# EAGLE design CAN-IO (EAGLE 7.2.0)
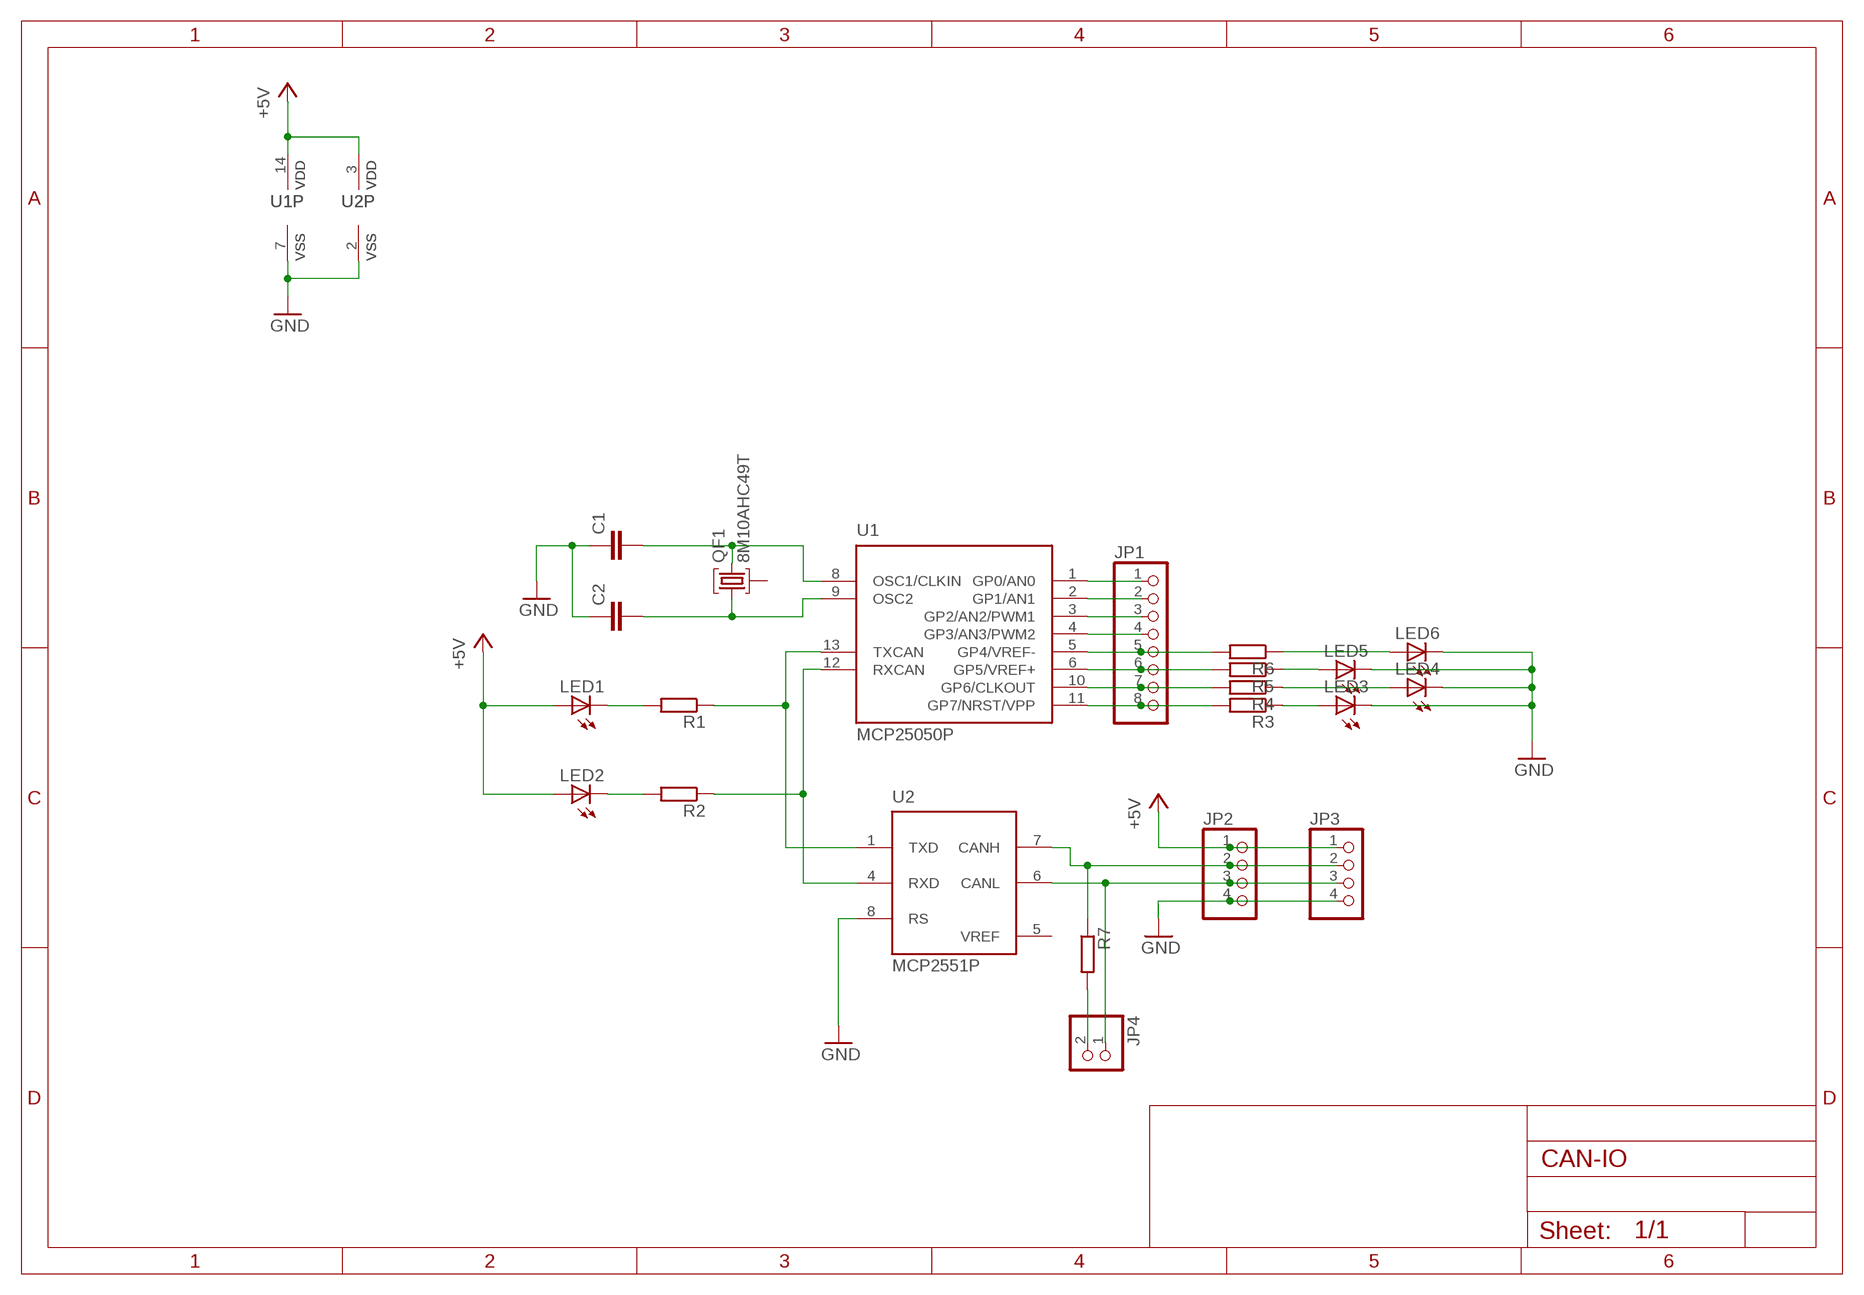
[diagram p0: schematic, sheet 1]

## Parts
C1  C-EU025-024X044  [C025-024X044]
C2  C-EU025-024X044  [C025-024X044]
JP1  PINHD-1X8  [1X08]
JP2  PINHD-1X4/90  [1X04/90]
JP3  PINHD-1X4/90  [1X04/90]
JP4  PINHD-1X2  [1X02]
LED1  LED5MM  [LED5MM]
LED2  LED5MM  [LED5MM]
LED3  LED5MM  [LED5MM]
LED4  LED5MM  [LED5MM]
LED5  LED5MM  [LED5MM]
LED6  LED5MM  [LED5MM]
QF1  8M10AHC49T  [HC49U]
R1  R-EU_0207/10  [0207/10]
R2  R-EU_0207/10  [0207/10]
R3  R-EU_0207/10  [0207/10]
R4  R-EU_0207/10  [0207/10]
R5  R-EU_0207/10  [0207/10]
R6  R-EU_0207/10  [0207/10]
R7  R-EU_0207/10  [0207/10]
U1  MCP25050P  [DIL14]
U2  MCP2551P  [DIL8]

## Nets
+5V: JP2.1 JP3.1 LED1.A LED2.A U1.14(VDD) U2.3(VDD)
GND: C1.1 C2.1 JP2.4 JP3.4 LED3.K(C) LED4.K(C) LED5.K(C) LED6.K(C) U1.7(VSS) U2.2(VSS) U2.8(RS)
N$1: R1.1 U1.13(TXCAN) U2.1(TXD)
N$2: R2.1 U1.12(RXCAN) U2.4(RXD)
N$3: LED1.K(C) R1.2
N$4: LED2.K(C) R2.2
N$5: LED3.A R3.1
N$6: JP1.1 U1.1(GP0/AN0)
N$7: JP1.2 U1.2(GP1/AN1)
N$8: JP1.3 U1.3(GP2/AN2/PWM1)
N$9: JP1.4 U1.4(GP3/AN3/PWM2)
N$10: JP1.5 R6.2 U1.5(GP4/VREF-)
N$11: JP1.6 R5.2 U1.6(GP5/VREF+)
N$12: JP1.7 R4.2 U1.10(GP6/CLKOUT)
N$13: JP1.8 R3.2 U1.11(GP7/NRST/VPP)
N$14: LED5.A R5.1
N$15: LED4.A R4.1
N$16: LED6.A R6.1
N$17: C1.2 QF1.3 U1.8(OSC1/CLKIN)
N$18: C2.2 QF1.1 U1.9(OSC2)
N$19: JP2.3 JP3.3 JP4.1 U2.6(CANL)
N$20: JP2.2 JP3.2 R7.1 U2.7(CANH)
N$22: JP4.2 R7.2
Unconnected: QF1.2

## Power pins joined to a net without a drawn wire
VREF: U2.5(VREF)

## Library data of the parts
C1 C2 = rcl:C-EU: CAPACITOR, European symbol
JP1 = pinhead:PINHD-1X8: PIN HEADER
JP2 JP3 = pinhead:PINHD-1X4: PIN HEADER
JP4 = pinhead:PINHD-1X2: PIN HEADER
LED1-LED6 = led:LED: LED OSRAM: - CHIPLED LG R971, LG N971, LY N971, LG Q971, LY Q971, LO R971, LY R971 LH N974, LH R974 LS Q976, LO Q976, LY Q976 LO Q996 - Hyper CHIPLED LW Q18S LB Q993, LB Q99A, LB R99A - SideLED LS A670, LO A670, LY A670, LG A670, LP A670 LB A673, LV A673, LT A673, LW A673 LH A674 LY A675 LS A676, LA A676, LO A676, LY A676, LW A676 LS A679, LY A679, LG A679 - Hyper Micro SIDELED® LS Y876, LA Y876, LO Y876, LY Y876 LT Y87S - SmartLED LW L88C, LW L88S LB L89C, LB L89S, LG L890 LS L89K, LO L89K, LY L89K LS L896, LA L896, LO L896, LY L896 - TOPLED LS T670, LO T670, LY T670, LG T670, LP T670 LSG T670, LSP T670, LSY T670, LOP T670, LYG T670 LG T671, LOG T671, LSG T671 LB T673, LV T673, LT T673, LW T673 LH T674 LS T676, LA T676, LO T676, LY T676, LB T676, LH T676, LSB T676, LW T676 LB T67C, LV T67C, LT T67C, LS T67K, LO T67K, LY T67K, LW E67C LS E67B, LA E67B, LO E67B, LY E67B, LB E67C, LV E67C, LT E67C LW T67C LS T679, LY T679, LG T679 LS T770, LO T770, LY T770, LG T770, LP T770 LB T773, LV T773, LT T773, LW T773 LH T774 LS E675, LA E675, LY E675, LS T675 LS T776, LA T776, LO T776, LY T776, LB T776 LHGB T686 LT T68C, LB T68C - Hyper Mini TOPLED® LB M676 - Mini TOPLED Santana® LG M470 LS M47K, LO M47K, LY M47K Source: http://www.osram.convergy.de LUXEON: - LUMILED® LXK2-PW12-R00, LXK2-PW12-S00, LXK2-PW14-U00, LXK2-PW14-V00 LXK2-PM12-R00, LXK2-PM12-S00, LXK2-PM14-U00 LXK2-PE12-Q00, LXK2-PE12-R00, LXK2-PE12-S00, LXK2-PE14-T00, LXK2-PE14-U00 LXK2-PB12-K00, LXK2-PB12-L00, LXK2-PB12-M00, LXK2-PB14-N00, LXK2-PB14-P00, LXK2-PB14-Q00 LXK2-PR12-L00, LXK2-PR12-M00, LXK2-PR14-Q00, LXK2-PR14-R00 LXK2-PD12-Q00, LXK2-PD12-R00, LXK2-PD12-S00 LXK2-PH12-R00, LXK2-PH12-S00 LXK2-PL12-P00, LXK2-PL12-Q00, LXK2-PL12-R00 Source: www.luxeon.com KINGBRIGHT: KA-3528ASYC Source: www.kingbright.com
QF1 = crystal:8M10AHC49T: Monolithic Crystal Filters Source: www.vanlong.com; OC_FARNELL: unknown; OC_NEWARK: unknown
R1-R7 = rcl:R-EU_: RESISTOR, European symbol
U1 = microchip_can:MCP25050: CAN I/O Expander ( with A/D )
U2 = microchip_can:MCP2551: High Speed CAN tranceiver

## Board
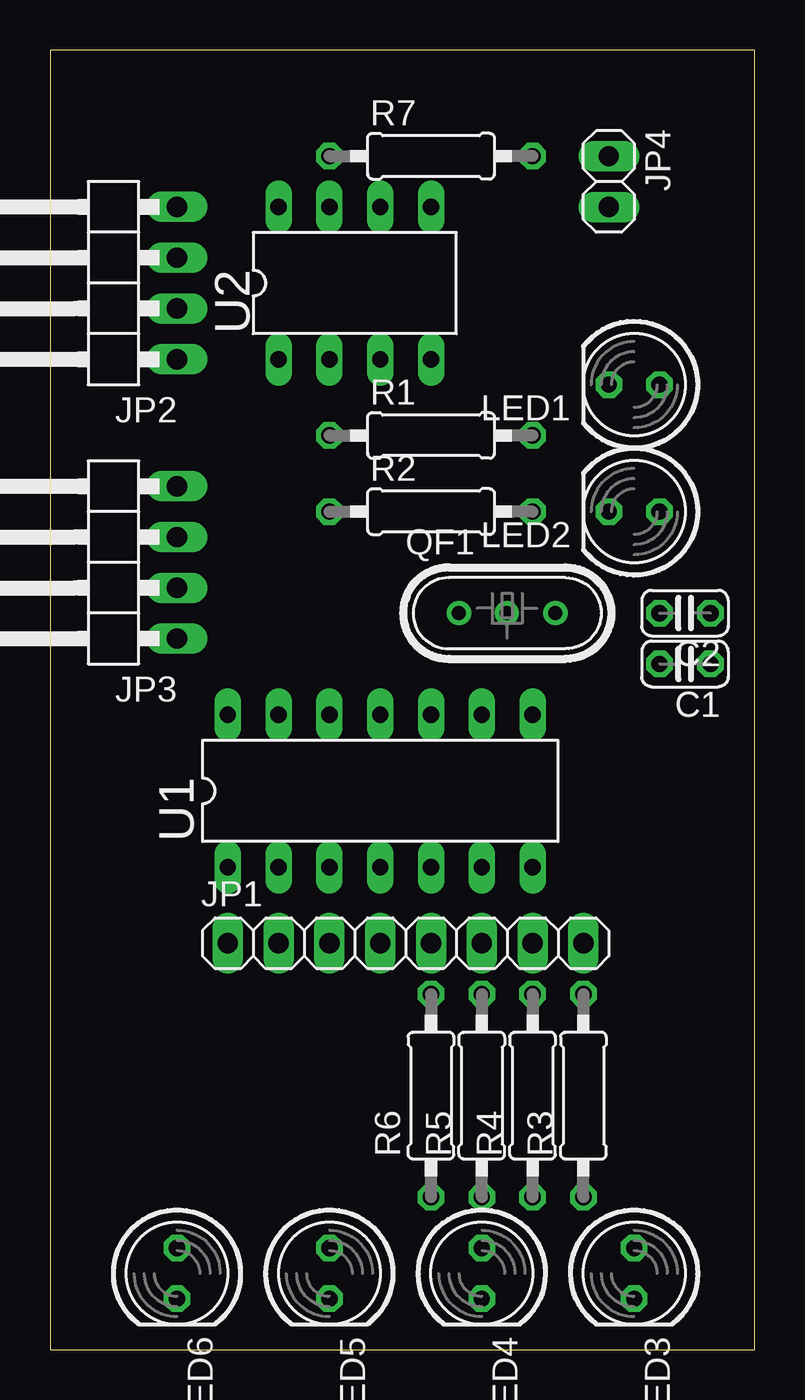
[diagram p1: board, top side]
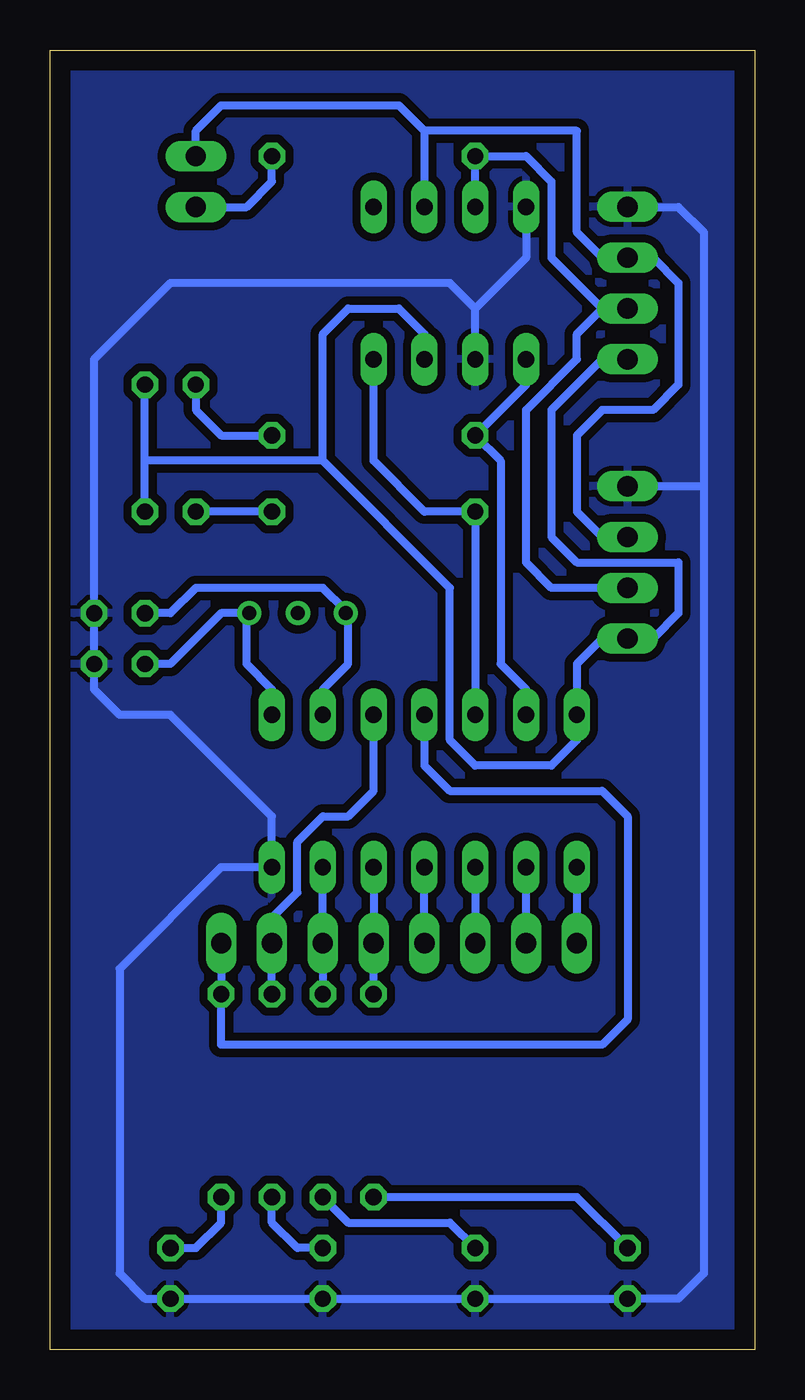
[diagram p2: board, bottom side, seen from below]

Size 35.23 x 65 mm. Coordinates in mm from the lower left corner, seen from the top.
Outline: 0,0 35.23,0 35.23,65 0,65 0,0
Copper layers (1*16): Top 0.035mm / dielectric 1.5mm / Bottom 0.035mm
Design rules "default *": minimum track width 10mil, minimum drill 24mil, track to track 16mil, track to pad 16mil, pad to pad 16mil, via to via 16mil, smd to smd 8mil, copper to edge 40mil, drill to drill 8mil, minimum pad ring 10mil, minimum via ring 8mil, stop-mask expansion 4mil, vias tented up to drill 0mil, thermal gap 10mil

### Footprints (pad centres in the part's own frame; a part is rotated, then mirrored left to right if it is on the bottom)
C025-024X044 = drill 0.813 octagon: 1 -1.27,0; 2 1.27,0
1X08 = drill 1.016 long: 1 -8.89,0; 2 -6.35,0; 3 -3.81,0; 4 -1.27,0; 5 1.27,0; 6 3.81,0; 7 6.35,0; 8 8.89,0
1X04/90 = drill 1.016 long: 1 -3.81,-3.81; 2 -1.27,-3.81; 3 1.27,-3.81; 4 3.81,-3.81
1X02 = drill 1.016 long: 1 -1.27,0; 2 1.27,0
LED5MM = drill 0.813 octagon: A -1.27,0; K 1.27,0
HC49U = drill 0.7 pad 1.2: 1 -2.413,0; 2 -0.027,0; 3 2.413,0
0207/10 = drill 0.813 octagon: 1 -5.08,0; 2 5.08,0
DIL14 = drill 0.813 long: 1 -10.16,-3.81; 2 -7.62,-3.81; 3 -5.08,-3.81; 4 -2.54,-3.81; 5 0,-3.81; 6 2.54,-3.81; 7 5.08,-3.81; 8 5.08,3.81; 9 2.54,3.81; 10 0,3.81; 11 -2.54,3.81; 12 -5.08,3.81; 13 -7.62,3.81; 14 -10.16,3.81
DIL8 = drill 0.813 long: 1 -3.81,-3.81; 2 -1.27,-3.81; 3 1.27,-3.81; 4 3.81,-3.81; 5 3.81,3.81; 6 1.27,3.81; 7 -1.27,3.81; 8 -3.81,3.81

### Placement (x,y rotation side)
C1  31.75,34.29 180 top
C2  31.75,36.83 180 top
JP1  17.78,20.32 0 top
JP2  2.54,53.34 90 top
JP3  2.54,39.37 90 top
JP4  27.94,58.42 270 top
LED1  29.21,48.26 180 top
LED2  29.21,41.91 180 top
LED3  29.21,3.81 270 top
LED4  21.59,3.81 270 top
LED5  13.97,3.81 270 top
LED6  6.35,3.81 270 top
QF1  22.86,36.83 0 top
R1  19.05,45.72 0 top
R2  19.05,41.91 0 top
R3  26.67,12.7 90 top
R4  24.13,12.7 90 top
R5  21.59,12.7 90 top
R6  19.05,12.7 90 top
R7  19.05,59.69 0 top
U1  19.05,27.94 0 top
U2  15.24,53.34 0 top

### Tracks (layer width: path | path; a pad name or v marks a point on that pad's centre or on a via)
+5V
  Bottom 0.406: LED2.A 30.48,44.45 | 30.48,44.45 LED1.A | 21.59,44.45 15.24,38.1 15.24,30.48 13.97,29.21 10.16,29.21 8.89,30.48 U1.14 8.89,34.29 7.62,35.56 JP3.1 5.08,35.56 3.81,36.83 3.81,39.37 8.89,39.37 10.16,40.64 10.16,46.99 7.62,49.53 JP2.1 | 21.59,44.45 30.48,44.45 | 21.59,44.45 21.59,50.8 20.32,52.07 17.78,52.07 16.51,50.8 U2.3
GND
  Bottom 0.406: U2.8 11.43,54.61 13.97,52.07 | U2.2 13.97,52.07 | 13.97,52.07 15.24,53.34 29.21,53.34 33.02,49.53 C2.1 C1.1 33.02,33.02 31.75,31.75 29.21,31.75 24.13,26.67 U1.7 26.67,24.13 31.75,19.05 31.75,3.81 30.48,2.54 LED3.K LED4.K LED5.K LED6.K 3.81,2.54 2.54,3.81 2.54,43.18 | JP2.4 3.81,57.15 2.54,55.88 2.54,43.18 | JP3.4 2.54,43.18
  pour Bottom: 0,0 0,63.5 35.56,63.5 35.56,0
N$1
  Bottom 0.406: U2.1 11.43,48.26 R1.1 12.7,44.45 12.7,34.29 11.43,33.02 U1.13
N$2
  Bottom 0.406: U1.12 R2.1 16.51,41.91 19.05,44.45 U2.4
N$3
  Bottom 0.406: LED1.K 27.94,46.99 26.67,45.72 R1.2
N$4
  Bottom 0.406: R2.2 LED2.K
N$5
  Bottom 0.406: LED3.A 27.94,5.08 26.67,6.35 R3.1
N$6
  Bottom 0.406: U1.1 JP1.1
N$7
  Bottom 0.406: JP1.2 U1.2
N$8
  Bottom 0.406: U1.3 JP1.3
N$9
  Bottom 0.406: JP1.4 U1.4
N$10
  Bottom 0.406: U1.5 JP1.5 R6.2
N$11
  Bottom 0.406: U1.6 JP1.6 R5.2
N$12
  Bottom 0.406: U1.10 19.05,27.94 20.32,26.67 21.59,26.67 22.86,25.4 22.86,22.86 24.13,21.59 JP1.7 R4.2
N$13
  Bottom 0.406: JP1.8 R3.2 26.67,15.24 7.62,15.24 6.35,16.51 6.35,26.67 7.62,27.94 15.24,27.94 16.51,29.21 U1.11
N$14
  Bottom 0.406: R5.1 20.32,6.35 15.24,6.35 LED5.A
N$15
  Bottom 0.406: LED4.A 22.86,5.08 24.13,6.35 R4.1
N$16
  Bottom 0.406: LED6.A 8.89,7.62 R6.1
N$17
  Bottom 0.406: U1.8 24.13,33.02 25.4,34.29 25.4,36.7 QF1.3 26.67,36.83 29.21,34.29 C1.2
N$18
  Bottom 0.406: U1.9 21.59,33.02 20.32,34.29 20.32,36.7 QF1.1 20.45,36.96 21.59,38.1 27.94,38.1 29.21,36.83 C2.2
N$19
  Bottom 0.406: 16.51,60.96 8.89,60.96 8.89,55.88 7.62,54.61 JP2.3 5.08,54.61 3.81,53.34 3.81,48.26 5.08,46.99 7.62,46.99 8.89,45.72 8.89,41.91 7.62,40.64 JP3.3 | 16.51,60.96 U2.6 | 16.51,60.96 17.78,62.23 26.67,62.23 27.94,60.96 JP4.1
N$20
  Bottom 0.406: U2.7 R7.1 11.43,59.69 10.16,58.42 10.16,54.61 7.62,52.07 | JP2.2 7.62,52.07 | JP3.2 10.16,38.1 11.43,39.37 11.43,46.99 8.89,49.53 8.89,50.8 7.62,52.07
N$21
  pour Bottom: 0,64.77 0,0 35.56,0 35.56,64.77
N$22
  Bottom 0.406: JP4.2 25.4,57.15 24.13,58.42 R7.2